# EAGLE design light_emitter (EAGLE 7.7.0)
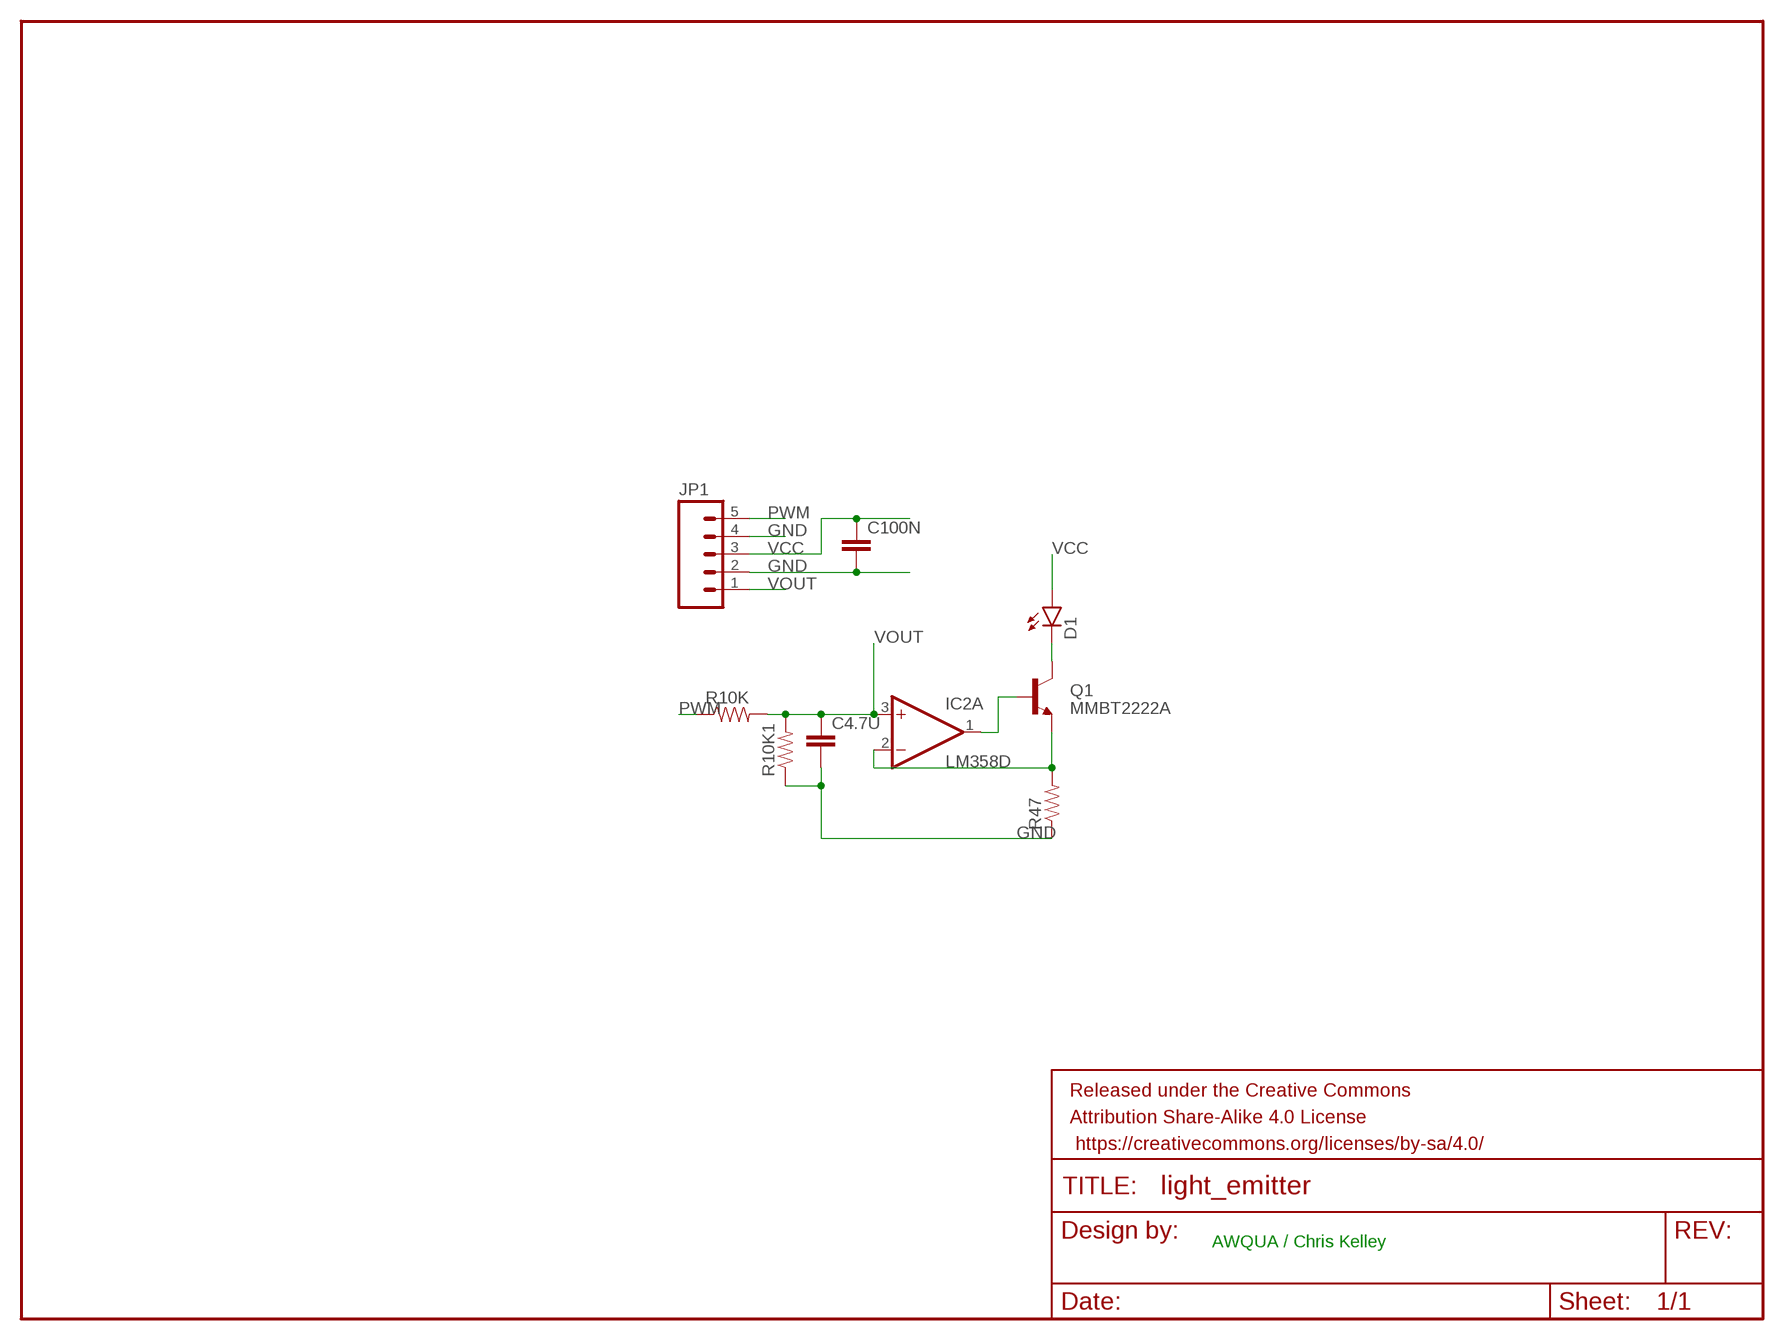
[diagram p0: schematic, sheet 1]

## Parts
C4.7U  CAP0603-CAP  [0603-CAP]
C100N  CAP0603-CAP  [0603-CAP]
D1  LED5MM  [LED5MM]
FRAME1  FRAME-LETTER  [CREATIVE_COMMONS]
IC2  LM358D  [SO08]
JP1  M05PTH  [1X05]
Q1  MMBT2222A  TRANSISTOR_NPNMMBT2222A  [SOT23-3]
R10K  RESISTOR0603-RES  [0603-RES]
R10K1  RESISTOR0603-RES  [0603-RES]
R47  RESISTOR0603-RES  [0603-RES]

## Nets
GND: C4.7U.2 C100N.2 JP1.2 JP1.4 R10K1.1 R47.1
N$1: IC2.2(A:-IN) Q1.2(E) R47.2
N$7: IC2.1(A:OUT) Q1.1(B)
N$9: D1.K(C) Q1.3(C)
PWM: JP1.5 R10K.1
VCC: C100N.1 D1.A JP1.3
VOUT: C4.7U.1 IC2.3(A:+IN) JP1.1 R10K1.2 R10K.2
Unconnected: IC2.5(B:+IN) IC2.6(B:-IN) IC2.7(B:OUT)

## Notes on the sheet
- AWQUA / Chris Kelley

## Power pins joined to a net without a drawn wire
V+: IC2.8(P:V+)
V-: IC2.4(P:V-)

## Library data of the parts
C4.7U C100N = SparkFun-Passives:CAP: Capacitor Standard 0603 ceramic capacitor, and 0.1" leaded capacitor.
D1 = SparkFun-LED:LED: LEDs Standard schematic elements and footprints for 5mm, 3mm, 1206, and 0603 sized LEDs. 5mm - Spark Fun Electronics SKU : COM-00529 (and others)
FRAME1 = SparkFun-Aesthetics:FRAME-LETTER: Schematic Frame Standard 8.5x11 US Letter frame
IC2 = linear:LM358: OP AMP also LM158; LM258; LM2904 Source: http://cache.national.com/ds/LM/LM158.pdf
JP1 = SparkFun-Connectors:M05: Header 5 Standard 5-pin 0.1" header. Use with straight break away headers (SKU : PRT-00116), right angle break away headers (PRT-00553), swiss pins (PRT-00743), machine pins (PRT-00117), and female headers (PRT-00115). Molex polarized connector foot print use with SKU : PRT-08230 with associated crimp pins and housings.
Q1 = SparkFun-DiscreteSemi:TRANSISTOR_NPN: Generic NPN BJT MMBT2222A - TRANS-08049 (SOT-23, 1A 40V) MPSA42 - TRANS-09116 (SOT-23, 500mA 300V) MMBT5088LT1G - TRANS-11160 (SOT-23, 50 mA 30V) BC547 - COM-08928 <http://www.sparkfun.com/products/8928> (TO-92 45V 100mA) (1.Collector 2.Base 3.Emitter) 2N3904 - COM-00521 <http://www.sparkfun.com/products/521> (TO-92 40V 200mA) (1.Emitter 2.Base 3.Collector) P2N2222A - COM-12852 <http://www.sparkfun.com/products/12852> (TO-92 40V 600mA) (1.Collector 2.Base 3.Emitter); PROD_ID: TRANS-08049
R10K R10K1 R47 = SparkFun-Passives:RESISTOR: Resistor Basic schematic elements and footprints for 0603, 1206, and PTH resistors.

## Board
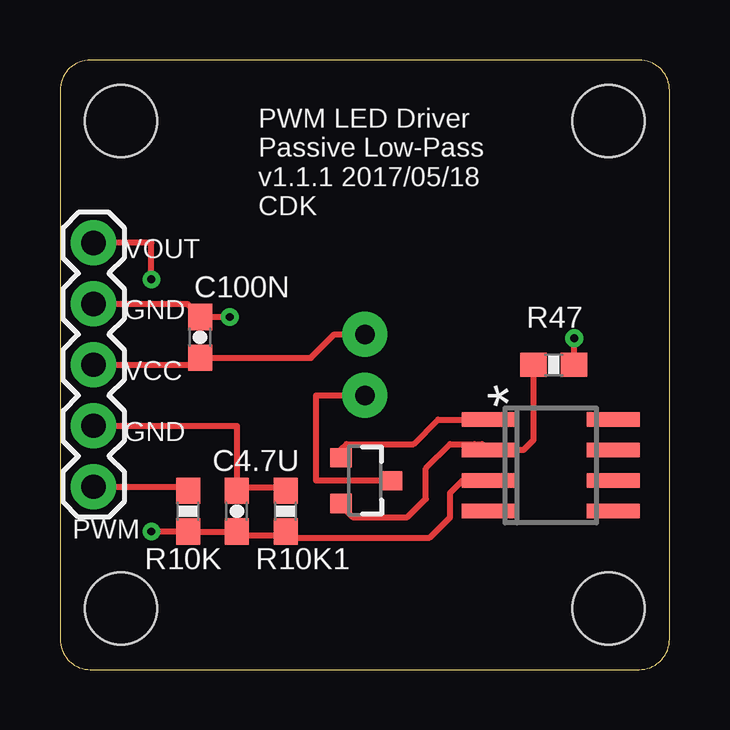
[diagram p1: board, top side]
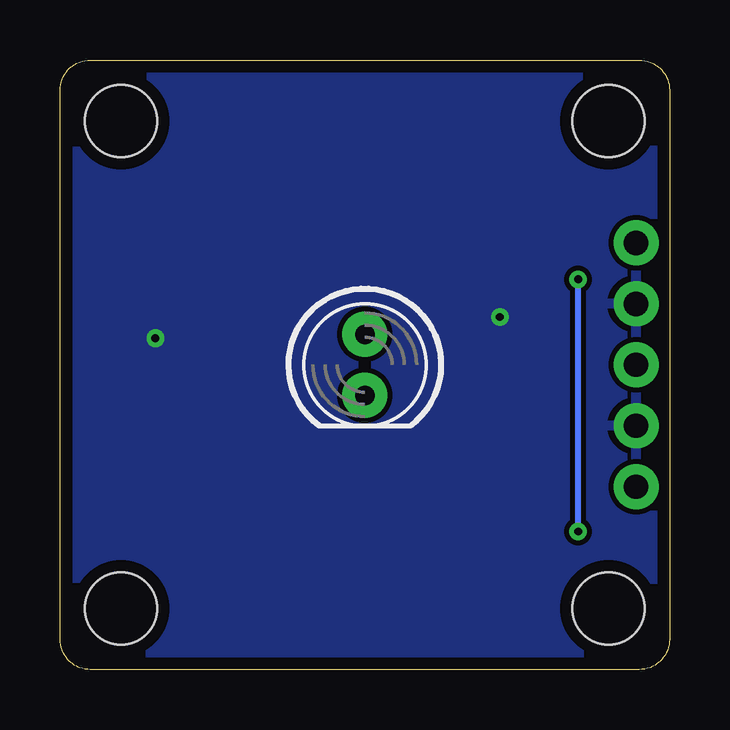
[diagram p2: board, bottom side, seen from below]

Size 25.4 x 25.4 mm. Coordinates in mm from the lower left corner, seen from the top.
Outline: 0,24.13 0,1.27 arc90 1.27,0 24.13,0 arc90 25.4,1.27 25.4,24.13 arc90 24.13,25.4 1.27,25.4 arc90 0,24.13
Copper layers (1*16): Top 0.035mm / dielectric 1.5mm / Bottom 0.035mm
Design rules "default *": minimum track width 10mil, minimum drill 24mil, track to track 8mil, track to pad 8mil, pad to pad 8mil, via to via 8mil, smd to smd 8mil, copper to edge 20mil, drill to drill 8mil, minimum pad ring 10mil, minimum via ring 8mil, stop-mask expansion 4mil, vias tented up to drill 13mil, thermal gap 10mil
Holes 3 mm at 2.54,22.86 22.86,22.86 22.86,2.54 2.54,2.54

### Footprints (pad centres in the part's own frame; a part is rotated, then mirrored left to right if it is on the bottom)
0603-CAP = smd 1.1 x 1: 1 -0.85,0; 2 0.85,0
LED5MM = drill 0.813 pad 1.88: A -1.27,0; K 1.27,0
SO08 = smd 0.6 x 2.2: 1 -1.905,-2.6; 2 -0.635,-2.6; 3 0.635,-2.6; 4 1.905,-2.6; 5 1.905,2.6; 6 0.635,2.6; 7 -0.635,2.6; 8 -1.905,2.6
1X05 = drill 1.016 pad 1.88: 1 0,0; 2 2.54,0; 3 5.08,0; 4 7.62,0; 5 10.16,0
SOT23-3 = smd 0.8 x 0.9: 1 -0.95,-1; 2 0.95,-1; 3 0,1.1
0603-RES = smd 1.1 x 1: 1 -0.85,0; 2 0.85,0

### Placement (x,y rotation side)
C4.7U  7.37,6.6 90 top
C100N  5.84,13.84 90 top
D1  12.7,12.7 270 bottom
FRAME1  5.08,-14.61 0 top  (outside the outline)
IC2  20.45,8.51 270 top
JP1  1.4,17.78 270 top
Q1  12.7,7.87 270 top
R10K  5.33,6.6 270 top
R10K1  9.4,6.6 270 top
R47  20.57,12.7 180 top

### Tracks (layer width: path | path; a pad name or v marks a point on that pad's centre or on a via)
GND  (via drill 0.33)
  Top 0.254: JP1.2 5.29,15.24 C100N.2 v7.07,14.69 | R47.1 v21.42,13.8 | JP1.4 7.37,10.16 C4.7U.2 7.49,7.58 9.27,7.58 R10K1.1
  pour Bottom: -1.65,27.94 31.37,27.94 31.37,-1.14 -1.91,-1.14
N$1
  Top 0.254: Q1.2 11.7,6.84 12.19,6.35 14.48,6.35 15.24,7.11 15.24,8.38 16.26,9.4 17.27,9.4 | 17.27,9.4 17.59,9.4 IC2.2 | R47.2 19.72,9.56 19.3,9.14 17.53,9.14 17.27,9.4
N$7
  Top 0.254: Q1.1 11.7,9.16 11.94,9.4 14.73,9.4 15.75,10.41 IC2.1
N$9
  Top 0.254: Q1.3 10.67,7.87 10.67,11.43 D1.K
PWM
  Top 0.254: JP1.5 5.68,7.62 R10K.1
VCC
  Top 0.254: JP1.3 5.55,12.7 C100N.1 10.45,12.99 11.43,13.97 D1.A
VOUT  (via drill 0.33)
  Top 0.254: IC2.3 16.76,7.87 16.26,7.37 16.26,6.35 15.41,5.5 9.4,5.5 R10K1.2 9.4,5.59 7.37,5.59 C4.7U.1 R10K.2 v3.81,5.75 | v3.81,16.26 3.81,17.78 JP1.1
  Bottom 0.254: v3.81,5.75 v3.81,16.26

### Text on the board
tPlace: PWM LED Driver / Passive Low-Pass / v1.1.1 2017/05/18 / CDK | VOUT | GND | VCC | GND | PWM
tNames: * | AWQUA / Chris Kelley